# Altium schematic sheet PA1_Alim.SchDoc
size 254 x 228 mm
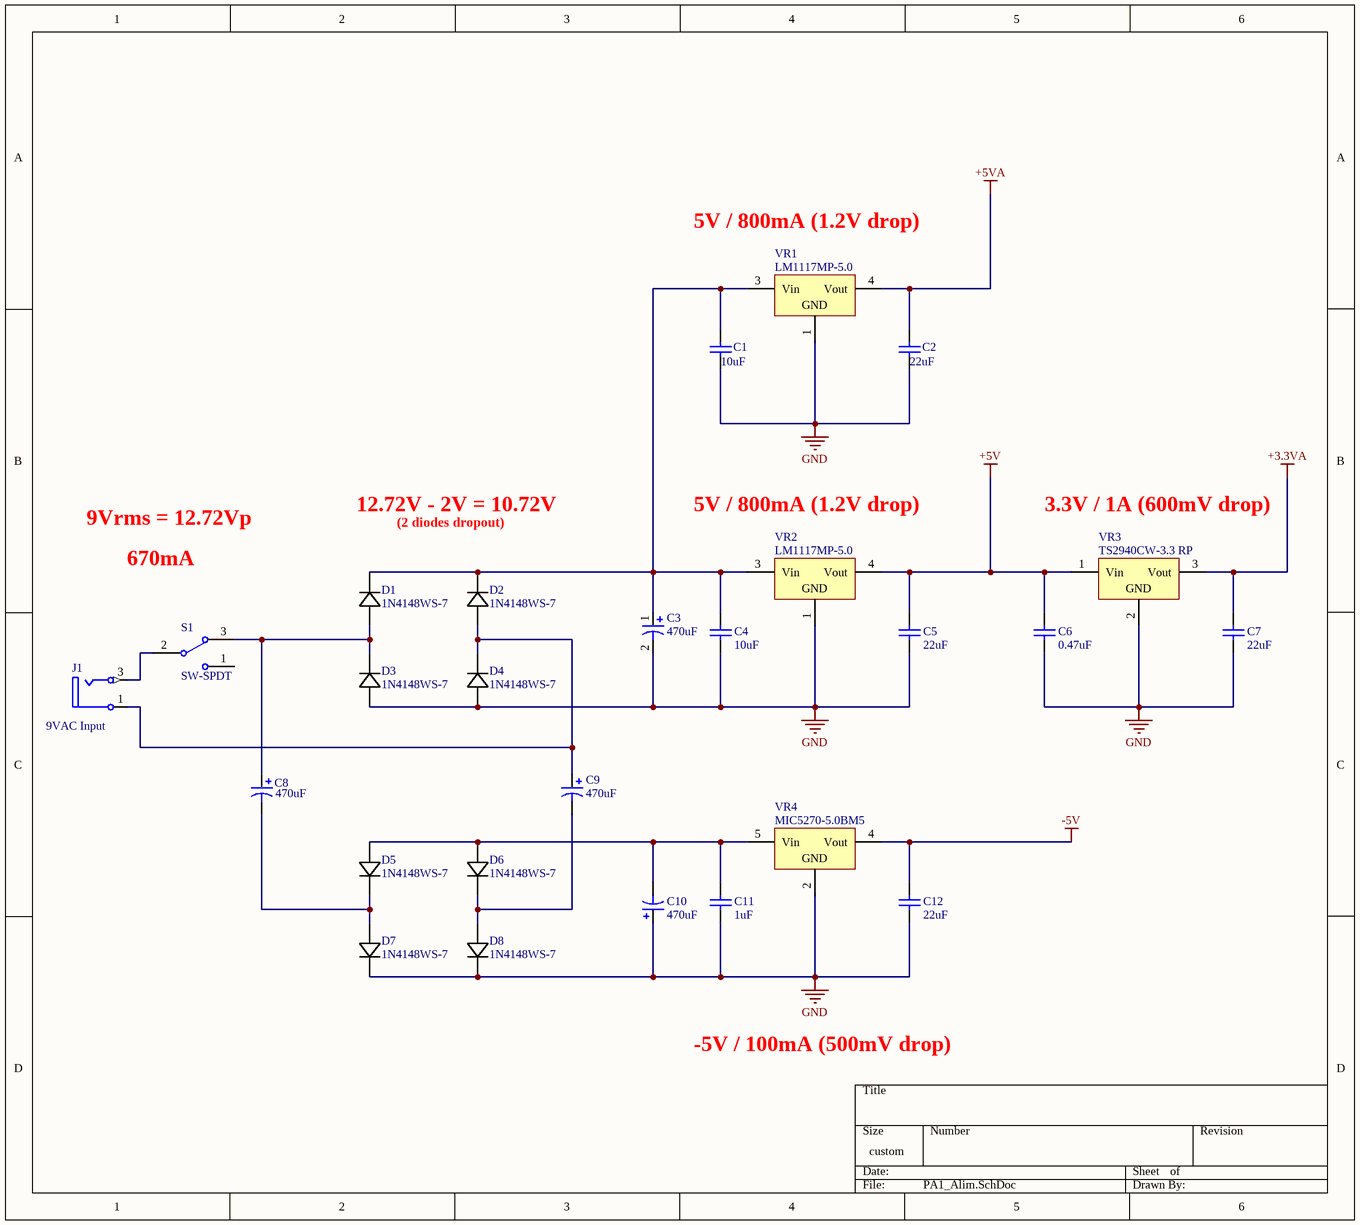
[diagram p0: PA1_Alim.SchDoc]

## Parts
C1  value 10uF  [CAPC1608X08]  (hidden comment: Cap 10uF)
C2  value 22uF  [CAPC1608X08]  (hidden comment: Cap 22uF)
C3  value 470uF  [CAPC100100X102]  (hidden comment: Cap 470uF)
C4  value 10uF  [CAPC1608X08]  (hidden comment: Cap 10uF)
C5  value 22uF  [CAPC1608X08]  (hidden comment: Cap 22uF)
C6  value 0.47uF  [CAPC1608X08]  (hidden comment: Cap 0.47uF)
C7  value 22uF  [CAPC1608X08]  (hidden comment: Cap 22uF)
C8  value 470uF  [CAPC100100X102]  (hidden comment: Cap 470uF)
C9  value 470uF  [CAPC100100X102]  (hidden comment: Cap 470uF)
C10  value 470uF  [CAPC100100X102]  (hidden comment: Cap 470uF)
C11  value 1uF  [CAPC1608X08]  (hidden comment: Cap 1uF)
C12  value 22uF  [CAPC1608X08]  (hidden comment: Cap 22uF)
D1  1N4148WS-7  [SOD323-M]
D2  1N4148WS-7  [SOD323-M]
D3  1N4148WS-7  [SOD323-M]
D4  1N4148WS-7  [SOD323-M]
D5  1N4148WS-7  [SOD323-M]
D6  1N4148WS-7  [SOD323-M]
D7  1N4148WS-7  [SOD323-M]
D8  1N4148WS-7  [SOD323-M]
J1  9VAC Input  [CLIFF ELECTRONIC COMPONENTS_FC681465P]
S1  SW-SPDT  [C&K_TS01ABE]
VR1  LM1117MP-5.0  [MP04A]
VR2  LM1117MP-5.0  [MP04A]
VR3  TS2940CW-3.3 RP  [SOT230P715X180-4N]
VR4  MIC5270-5.0BM5  [SOT95P280X130-5N]

## Nets
+3.3VA: C7.2 VR3.3(Vout)
+5V: C5.2 C6.2 VR2.4(Vout) VR3.1(Vin)
+5VA: C2.2 VR1.4(Vout)
-5V: C12.2 VR4.4(Vout)
GND: C1.1 C2.1 C3.2 C4.1 C5.1 C6.1 C7.1 C10.1 C11.1 C12.1 D3.2 D4.2 D7.1 D8.1 VR1.1(GND) VR2.1(GND) VR3.2(GND) VR4.2(GND)
NetC1_2: C1.2 C3.1 C4.2 D1.1 D2.1 VR1.3(Vin) VR2.3(Vin)
NetC8_1: C8.1 D1.2 D3.1 S1.3
NetC8_2: C8.2 D5.1 D7.2
NetC9_1: C9.1 D2.2 D4.1 J1.1(S)
NetC9_2: C9.2 D6.1 D8.2
NetC10_2: C10.2 C11.2 D5.2 D6.2 VR4.5(Vin)
NetJ1_3: J1.3(T) S1.2

Not connected (* = marked no-connect by the designer): S1 1

## Notes on the sheet
- 5V / 800mA (1.2V drop)
- 9Vrms = 12.72Vp
- 670mA
- 12.72V - 2V = 10.72V
- (2 diodes dropout)
- 3.3V / 1A (600mV drop)
- -5V / 100mA (500mV drop)

## Library data of the parts
C1 C4 = Cap Semi: Capacitor; Fabricant: TDK; Fournisseur: Farnell; RefFabricant: C1608X5R1A106M080AC; RefFournisseur: 2309028; Case: 0603 [1608 Metric]; DataSheet: http://www.farnell.com/datasheets/2291921.pdf
C2 C5 C7 C12 = Cap Semi: Capacitor; Fabricant: MURATA; Fournisseur: Farnell; RefFabricant: GRM188R61A226ME15D; RefFournisseur: 2426957; Case: 0603 [1608 Metric]; DataSheet: http://www.farnell.com/datasheets/2047978.pdf
C3 C8-C10 = Cap Pol1: Polarized Capacitor (Radial); Fabricant: PANASONIC ELECTRONIC COMPONENTS; Fournisseur: Farnell; RefFabricant: EEEFK1E471P; RefFournisseur: 9695800; Case: [10mm]; DataSheet: http://www.farnell.com/datasheets/2002520.pdf
C6 = Cap Semi: Capacitor; Fabricant: TDK; Fournisseur: Farnell; RefFabricant: C1608X5R1H474K080AB; RefFournisseur: 2211183; Case: 0603 [1608 Metric]; DataSheet: http://www.farnell.com/datasheets/2291921.pdf
C11 = Cap Semi: Capacitor; Fabricant: MURATA; Fournisseur: Farnell; RefFabricant: GRM188F51A105ZA01D; RefFournisseur: 1828847; Case: 0603 [1608 Metric]; DataSheet: http://www.farnell.com/datasheets/2048756.pdf
D1-D8 = 1N4148WS-7: Diode signaux faibles; RefFournisseur: 2453269; Fabricant: ON SEMICONDUCTOR; Fournisseur: Farnell; RefFabricant: 1N4148WS; DataSheet: http://www.farnell.com/datasheets/2288055.pdf
J1 = Phonejack2: Jack Socket Thru-Hole Vertical 2-Conductor Open Circuit; Fabricant: CLIFF ELECTRONIC COMPONENTS; Fournisseur: Farnell; RefFabricant: FC681465P; RefFournisseur: 1854512; DataSheet: http://www.farnell.com/datasheets/1855458.pdf
S1 = SW-SPDT: SPDT Subminiature Toggle Switch, Right Angle Mounting, Vertical Actuation; Fabricant: C & K COMPONENTS; Fournisseur: Farnell; RefFabricant: TS01ABE; RefFournisseur: 2435185; DataSheet: http://www.farnell.com/datasheets/1839865.pdf
VR1 VR2 = Volt Reg: Voltage Regulator; Fabricant: TEXAS INSTRUMENTS; Fournisseur: Farnell; RefFournisseur: 9778209; DataSheet: http://www.farnell.com/datasheets/2019100.pdf; RefFabricant: LM1117MP-5.0
VR3 = Volt Reg: Voltage Regulator; Fabricant: TAIWAN SEMICONDUCTOR; Fournisseur: Farnell; RefFournisseur: 7261403; DataSheet: http://www.farnell.com/datasheets/2044143.pdf; RefFabricant: TS2940CW-3.3 RP
VR4 = Volt Reg: Voltage Regulator; Fabricant: MICROCHIP; Fournisseur: Farnell; RefFabricant: MIC5270-5.0YM5-TR; RefFournisseur: 2510308; DataSheet: http://www.farnell.com/datasheets/29611.pdf